# Altium schematic sheet Connectors.SchDoc
size 279 x 215 mm; SheetNumber: 1; SheetTotal: 4
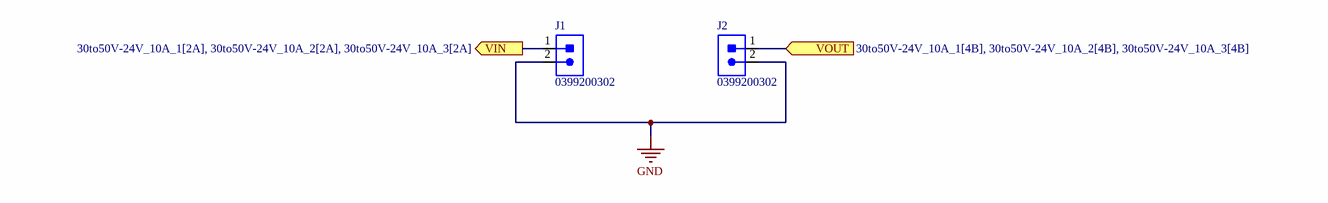
[diagram p0: Connectors.SchDoc]

## Parts
J1  Manufacturer Part Number 1: 0399200302  [MOLEX-0399200302]  (hidden comment: CONN_SCREW_TERM_115A)
J2  Manufacturer Part Number 1: 0399200302  [MOLEX-0399200302]  (hidden comment: CONN_SCREW_TERM_115A)

## Ports
VIN (out, see 30to50V-24V_10A_1[2A], 30to50V-24V_10A_2[2A], 30to50V-24V_10A_3[2A]), VOUT (in, see 30to50V-24V_10A_1[4B], 30to50V-24V_10A_2[4B], 30to50V-24V_10A_3[4B])

## Nets
GND: J1.2 J2.2
VIN: J1.1 ; port VIN
VOUT: J2.1 ; port VOUT

## Notes on the sheet
- University of Waterloo Robotics Team
- 200 University Ave W
- REV
- PROJECT
- Waterloo, Ontario, Canada
- N2L 3G1
- DOCUMENT
- ENGINEER
- REVIEWER
- MODIFIED
- SHEET
- OF

## Library data of the parts
J1 J2 = CONN_SCREW_TERM_115A: CONN TERM BLOCK 2POS 15MM 1-8AWG; Manufacturer 1: Molex; Pitch: 0.591inch; Wire Gauge (Max): 8AWG; Wire Gauge (Min): 1AWG; Supplier 1: Digi-Key; Supplier Part Number 1: WM20114-ND